# Altium schematic sheet Mainboard_V1.0_Ethernet.SchDoc: Mainboard
size A4; PageSetup: Record=PageOptions|CenterHorizontal=True|CenterVertical=True|PrintScale=0.97|XCorrection=1.00|YCorrection=1.00|PrintKind=0|BorderSize=5000000|LeftOffset=0|BottomOffset=0|Orientation=2|PaperLength=1000|PaperWidth=1000|Scale=100|PaperSource=7|PrintQuality=-3|MediaType=1|DitherType=10|PrintScaleMode=1|PaperKind=A4|PaperIndex=9; Organization: Ostschweizer Fachhochschule; Address2: Florian Baumgartner & Thierry Schwaller; Address3: florian.baumgartner@ost.ch; DocumentNumber: 4; Revision: V1.0; SheetNumber: 4; SheetTotal: 7; Author: Florian Baumgartner & Alain Keller; Subtitle: Ethernet PoE (IEEE 802.3at)
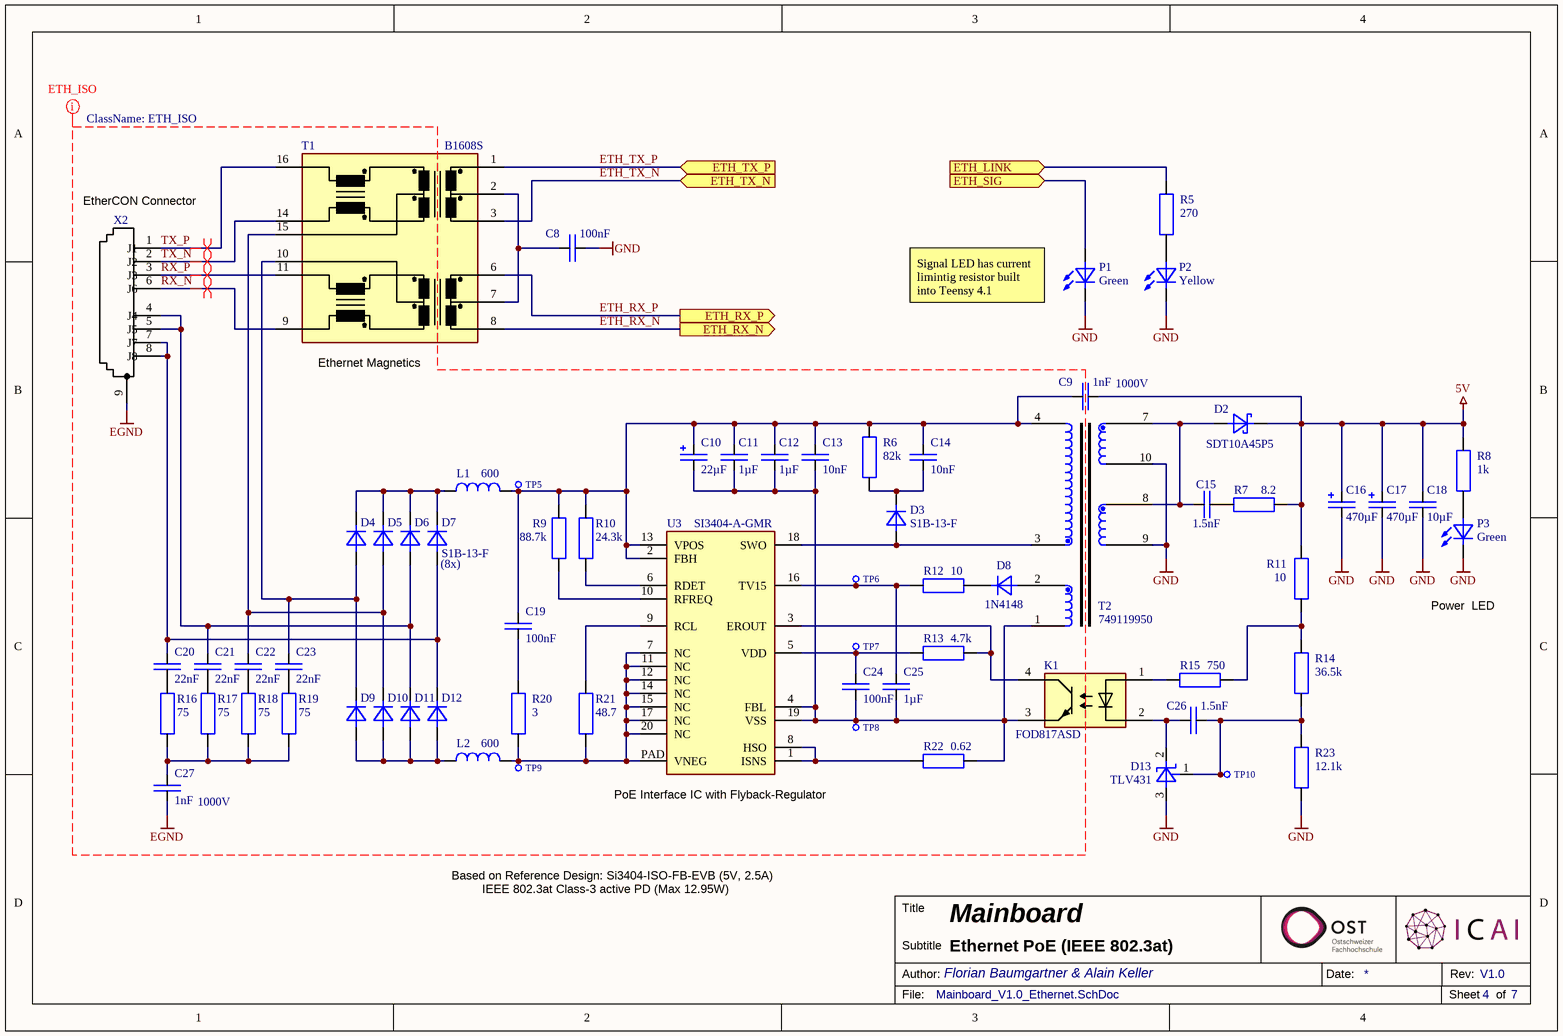
[diagram p0: Mainboard_V1.0_Ethernet.SchDoc]

## Parts
C8  100nF  [SMD Keramikkondensator 0603]
C9  1nF  [SMD KERAMIKKONDENSATOR 1808]
C10  22µF  [SMD Elko 6.3x7.7]
C11  1µF  [SMD Keramikkondensator 1206]
C12  1µF  [SMD Keramikkondensator 1206]
C13  10nF  [SMD Keramikkondensator 0603]
C14  10nF  [SMD Keramikkondensator 0603]
C15  1.5nF  [SMD Keramikkondensator 0603]
C16  470µF  [SMD Elko 6.3x7.7]
C17  470µF  [SMD Elko 6.3x7.7]
C18  10µF  [SMD Keramikkondensator 1206]
C19  100nF  [SMD Keramikkondensator 0805]
C20  22nF  [SMD Keramikkondensator 0603]
C21  22nF  [SMD Keramikkondensator 0603]
C22  22nF  [SMD Keramikkondensator 0603]
C23  22nF  [SMD Keramikkondensator 0603]
C24  100nF  [SMD Keramikkondensator 0603]
C25  1µF  [SMD Keramikkondensator 0603]
C26  1.5nF  [SMD Keramikkondensator 0603]
C27  1nF  [SMD KERAMIKKONDENSATOR 1808]
D2  SDT10A45P5  [SMD Diode PowerDI-5]
D3  S1B-13-F  [SMD Diode DO-214-AC]
D4  S1B-13-F  [SMD Diode DO-214-AC]  (value not drawn)
D5  S1B-13-F  [SMD Diode DO-214-AC]  (value not drawn)
D6  S1B-13-F  [SMD Diode DO-214-AC]  (value not drawn)
D7  S1B-13-F  [SMD Diode DO-214-AC]
D8  1N4148  [SMD Diode SOD-123]
D9  S1B-13-F  [SMD Diode DO-214-AC]  (value not drawn)
D10  S1B-13-F  [SMD Diode DO-214-AC]  (value not drawn)
D11  S1B-13-F  [SMD Diode DO-214-AC]  (value not drawn)
D12  S1B-13-F  [SMD Diode DO-214-AC]  (value not drawn)
D13  TLV431  [SMD IC SOT-23-3]
K1  FOD817ASD  [SMD IC DIP-4]
L1  600  [SMD INDUCTOR/FERRITE 0805]
L2  600  [SMD INDUCTOR/FERRITE 0805]
P1  Green  [SMD LED 0603]
P2  Yellow  [SMD LED 0603]
P3  Green  [SMD LED 0603]
R5  270  [SMD Widerstand 0603]
R6  82k  [SMD Widerstand 0603]
R7  8.2  [SMD Widerstand 0603]
R8  1k  [SMD Widerstand 0603]
R9  88.7k  [SMD Widerstand 0603]
R10  24.3k  [SMD Widerstand 0603]
R11  10  [SMD Widerstand 0603]
R12  10  [SMD Widerstand 0603]
R13  4.7k  [SMD Widerstand 0603]
R14  36.5k  [SMD Widerstand 0603]
R15  750  [SMD Widerstand 0603]
R16  75  [SMD Widerstand 0603]
R17  75  [SMD Widerstand 0603]
R18  75  [SMD Widerstand 0603]
R19  75  [SMD Widerstand 0603]
R20  3  [SMD Widerstand 0603]
R21  48.7  [SMD Widerstand 0603]
R22  0.62  [SMD Widerstand 0603]
R23  12.1k  [SMD Widerstand 0603]
T1  B1608S  [SMD Transformer 500x375]
T2  749119950  [SMD Transformer 749119950]
TP5  X-TP  [THT Testpunkt Ø1mm]  (value not drawn)  (no BOM)
TP6  X-TP  [THT Testpunkt Ø1mm]  (value not drawn)  (no BOM)
TP7  X-TP  [THT Testpunkt Ø1mm]  (value not drawn)  (no BOM)
TP8  X-TP  [THT Testpunkt Ø1mm]  (value not drawn)  (no BOM)
TP9  X-TP  [THT Testpunkt Ø1mm]  (value not drawn)  (no BOM)
TP10  X-TP  [THT Testpunkt Ø1mm]  (value not drawn)  (no BOM)
U3  SI3404-A-GMR  [SMD IC QFN-20]
X2  NE8FBV-C5-LED1-S  [THT CONNECTOR NE8FBV-C5-LED1-S]  (value not drawn)

## Ports
ETH_LINK (in), ETH_RX_N (out), ETH_RX_P (out), ETH_SIG (in), ETH_TX_N (in), ETH_TX_P (in)

## Nets
5V: C9.1 C16.P(+) C17.P(+) C18.2 D2.K R7.1 R8.2 R11.1
EGND: C27.1 X2.9
GND: C8.2 C16.M(-) C17.M(-) C18.1 D13.3(A) P1.K P2.K P3.K R23.2 T2.9 T2.10
ETH_LINK: R5.1 ; port ETH_LINK
ETH_RX_N: T1.8(RD-) ; port ETH_RX_N
ETH_RX_P: T1.6(RD+) ; port ETH_RX_P
ETH_SIG: P1.A ; port ETH_SIG
ETH_TX_N: T1.3(TD-) ; port ETH_TX_N
ETH_TX_P: T1.1(TD+) ; port ETH_TX_P
RX_N: T1.9(RX-) X2.6
RX_P: T1.11(RX+) X2.3
TX_N: T1.14(TX-) X2.2
TX_P: T1.16(TX+) X2.1
NetC8_1: C8.1 T1.2(TCT) T1.7(RCT)
NetC9_2: C9.2 C10.P(+) C11.2 C12.2 C13.1 C14.1 C19.1 L1.2 R6.1 R9.1 R10.1 T2.4 TP5.1 U3.2(FBH) U3.13(VPOS)
NetC10_M: C10.M(-) C11.1 C12.1 C13.2 C24.2 C25.1 K1.3(TE) R22.2 T2.1 TP8.1 U3.4(FBL) U3.19(VSS)
NetC14_2: C14.2 D3.K R6.2
NetC15_1: C15.1 R7.2
NetC15_2: C15.2 D2.A T2.7 T2.8
NetC19_2: C19.2 R20.1
NetC20_1: C20.1 D7.A D12.K X2.7 X2.8
NetC20_2: C20.2 R16.1
NetC21_1: C21.1 D6.A D11.K X2.4 X2.5
NetC21_2: C21.2 R17.1
NetC22_1: C22.1 D5.A D10.K T1.15(TXCT)
NetC22_2: C22.2 R18.1
NetC23_1: C23.1 D4.A D9.K T1.10(RXCT)
NetC23_2: C23.2 R19.1
NetC24_1: C24.1 R13.2 TP7.1 U3.5(VDD)
NetC25_2: C25.2 R12.2 TP6.1 U3.16(TV15)
NetC26_1: C26.1 D13.1(REF) R14.2 R23.1 TP10.1
NetC26_2: C26.2 D13.2(C) K1.2(LC)
NetC27_2: C27.2 R16.2 R17.2 R18.2 R19.2
NetD3_A: D3.A T2.3 U3.18(SWO)
NetD4_K: D4.K D5.K D6.K D7.K L1.1
NetD8_A: D8.A T2.2
NetD8_K: D8.K R12.1
NetD9_A: D9.A D10.A D11.A D12.A L2.1
NetK1_1: K1.1(LA) R15.1
NetK1_4: K1.4(TC) R13.1 U3.3(EROUT)
NetL2_2: L2.2 R20.2 R21.2 TP9.1 U3.7(NC) U3.11(NC) U3.12(NC) U3.14(NC) U3.15(NC) U3.17(NC) U3.20(NC) U3.PAD(VNEG)
NetP2_A: P2.A R5.2
NetP3_A: P3.A R8.1
NetR9_2: R9.2 U3.10(RFREQ)
NetR10_2: R10.2 U3.6(RDET)
NetR11_2: R11.2 R14.1 R15.2
NetR21_1: R21.1 U3.9(RCL)
NetR22_1: R22.1 U3.1(ISNS) U3.8(HSO)

Not connected (* = marked no-connect by the designer): T1 4(NC) 5(NC) 12(NC) 13(NC); T2 5 6

## Layout directives
net class ETH_ISO: EGND, RX_N, RX_P, TX_N, TX_P
differential pair: RX_N, RX_P, TX_N, TX_P

## Notes on the sheet
- (near X2) EtherCON Connector
- (near P1) Signal LED has current limintig resistor built into Teensy 4.1
- (near T1) Ethernet Magnetics
- 1000V
- (near D7) (8x)
- Power  LED
- (near U3) PoE Interface IC with Flyback-Regulator
- (near C27) 1000V
- IEEE 802.3at Class-3 active PD (Max 12.95W)
- Based on Reference Design: Si3404-ISO-FB-EVB (5V, 2.5A)
- Title
- Author:
- Subtitle
- Date:
- Rev:
- File:
- Sheet
- of
- (in symbol X-NE8FBV-C5-LED1-S) J1; J2; J3; J6; J4; J5; J7; J8

## Library data of the parts
C8 C24 = E6 - 100nF: SMD Ceramic Capacitor E6; Component Value: 100nF 50V; Component Description: Multilayer Ceramic Capacitors; ComponentLink1Description: Datasheet; ComponentLink1URL: https://datasheet.lcsc.com/lcsc/1809301912_YAGEO-CC0603KRX7R9BB104_C14663.pdf; Digikey: 445-5666-1-ND; Farnell: 2522432; JLC-Parts: C14663; Mouser: 77-VJ0603V104ZXAPBC; Unit Price: 0.01
C9 C27 = E6 - 1nF: SMD Ceramic Capacitor E6; Component Value: 1nF 3kV; Component Description: Multilayer Ceramic Capacitors MLCC; ComponentLink1Description: Datasheet; ComponentLink1URL: https://datasheet.lcsc.com/lcsc/1912111437_Johanson-Dielectrics-302R29W102KV4E_C173224.pdf; Digikey: 709-1047-1-ND; Farnell: 1886070; JLC-Parts: C173224; Mouser: 605-302R29W102KV4E; Unit Price: 0.06
C10 = C-ELCAP: CAP-Elko; Component Description: Electrolytic Capacitor; Component Value: 22µF 100V; JLC-Parts: C5456761; Unit Price: 0.06
C11 C12 = C-CAPACITOR: CAP-MK; Component Description: Multilayer Ceramic Capacitors; Component Value: 1µF 100V; Digikey: 720-VJ1206Y104MXBATCT-ND; Farnell: 1657939; Mouser: 77-VJ1206Y104MXBAT; JLC-Parts: C13832; Unit Price: 0.01
C13 C14 = E6 - 22nF: SMD Ceramic Capacitor E6; Component Value: 10nF 100V; Component Description: Multilayer Ceramic Capacitors MLCC; ComponentLink1Description: Datasheet; ComponentLink1URL: https://datasheet.lcsc.com/lcsc/1811101610_Samsung-Electro-Mechanics-CL10B223KB8NNNC_C21122.pdf; Digikey: 490-4781-1-ND; Farnell: 2470432; JLC-Parts: C302008; Mouser: 81-GCM188R72A103KA7D; Unit Price: 0.01
C15 C26 = C-CAPACITOR: CAP-MK; Component Description: Multilayer Ceramic Capacitors; Component Value: 1.5nF 50V; Digikey: 445-6920-1-ND; Farnell: 2435474; Mouser: 810-CGA3E2X7R1H152K; JLC-Parts: C1595; Unit Price: 0.01
C16 C17 = C-ELCAP: CAP-Elko; Component Description: Electrolytic Capacitor; Component Value: 470µF 6.3V; JLC-Parts: C72520; Unit Price: 0.03
C18 = E6 - 10uF: SMD Ceramic Capacitor E6; Component Value: 10µF 50V; Component Description: Multilayer Ceramic Capacitors MLCC; ComponentLink1Description: Datasheet; ComponentLink1URL: https://datasheet.lcsc.com/lcsc/1810191219_Samsung-Electro-Mechanics-CL10A106KP8NNNC_C19702.pdf; Digikey: 587-3258-1-ND; Farnell: 2113070; JLC-Parts: C13585; Mouser: 963-LMK107BBJ106MALT; Unit Price: 0.01
C19 = E6 - 22nF: SMD Ceramic Capacitor E6; Component Value: 100nF 100V; Component Description: Multilayer Ceramic Capacitors MLCC; ComponentLink1Description: Datasheet; ComponentLink1URL: https://datasheet.lcsc.com/lcsc/1811101610_Samsung-Electro-Mechanics-CL10B223KB8NNNC_C21122.pdf; Digikey: 490-4789-1-ND; Farnell: 2470440; JLC-Parts: C28233; Mouser: 81-GCM21BR72A104KA7L; Unit Price: 0.01
C20-C23 = E6 - 22nF: SMD Ceramic Capacitor E6; Component Value: 22nF 100V; Component Description: Multilayer Ceramic Capacitors MLCC; ComponentLink1Description: Datasheet; ComponentLink1URL: https://datasheet.lcsc.com/lcsc/1811101610_Samsung-Electro-Mechanics-CL10B223KB8NNNC_C21122.pdf; Digikey: 490-4782-1-ND; Farnell: 2494195; JLC-Parts: C161234; Mouser: 81-GCM188R72A223KA7D; Unit Price: 0.01
C25 = C-CAPACITOR: CAP-MK; Component Description: Multilayer Ceramic Capacitors; Component Value: 1µF 50V; Digikey: 1276-1860-1-ND; Farnell: 3013383; Mouser: 187-CL10A105KB8NNNC; JLC-Parts: C15849; Unit Price: 0.01
D2 = R-DIODE:SCHKY: Trench Schottky Barrier Rectifier; Component Value: SDT10A45P5-13; Mouser: 621-SDT10A45P5-13; Farnell: 3944970; Digikey: 31-SDT10A45P5-13CT-ND; JLC-Parts: C2997843; Component Description: Trench Schottky Barrier Rectifier; Unit Price: 0.19; ComponentLink1Description: Datasheet; ComponentLink1URL: https://www.diodes.com/assets/Datasheets/SDT10A45P5.pdf
D3-D7 D9-D12 = R-DIODE: DIODE (alt V); Component Description: General Purpose Rectifier Diode; Digikey: S1B-FDICT-ND; Farnell: 3127425; Mouser: 621-S1B-F; ComponentLink1Description: Datasheet; ComponentLink1URL: https://www.diodes.com/assets/Datasheets/ds16003.pdf; Component Value: S1B-13-F; JLC-Parts: C156295; Unit Price: 0.03
D8 = R-DIODE: DIODE (alt V); Component Description: Fast Switching Diode; Component Value: 1N4148WTR; Digikey: 1655-1360-1-ND; Farnell: 2306363; Mouser: 750-1N4148W-HF; ComponentLink1Description: Datasheet; ComponentLink1URL: https://datasheet.lcsc.com/lcsc/1811061725_ST-Semtech-1N4148W_C81598.pdf; JLC-Parts: C81598; Unit Price: 0.01
D13 = D-Voltage-Refference: Low-Voltage Adjustable Precision Shunt Regulator; Component Value: TLV431BCDBZR; Mouser: 595-TLV431BCDBZR; Digikey: 296-17569-1-ND; JLC-Parts: C2156583; ComponentLink1Description: Datasheet; ComponentLink1URL: https://www.ti.com/general/docs/suppproductinfo.tsp?distId=10&gotoUrl=https%3A%2F%2Fwww.ti.com%2Flit%2Fgpn%2Ftlv431a; Component Description: Low-Voltage Adjustable Precision Shunt Regulator; Unit Price: 0.59
K1 = K-FOD817ASD: Phototransistor Optocoupler; Digikey: FOD817ASDDKR-ND; Farnell: 2322515; Mouser: 512-FOD817ASD; Component Description: Phototransistor Optocoupler; ComponentLink1Description: Datasheet; ComponentLink1URL: https://rocelec.widen.net/view/pdf/yhg4flovvn/ONSM-S-A0003163276-1.pdf?t.download=true&u=5oefqw; Component Value: FOD817ASD; JLC-Parts: C241830; Unit Price: 0.25
L1 L2 = R-COIL (HF): COIL (Spule alt L); Component Description: Ferrite Bead; Component Value: CBM201209U601T (600 Ohm@100MHz, 2000mA); Farnell: 1838838; Mouser: 623-2508056017Y2; Digikey: 1934-1487-1-ND; ComponentLink1Description: Datasheet; ComponentLink1URL: https://datasheet.lcsc.com/lcsc/2304140030_FH--Guangdong-Fenghua-Advanced-Tech-CBM201209U601T_C139168.pdf; JLC-Parts: C139168; Unit Price: 0.01
P1 = P-LED: LED (als Lampe E / alt H); Component Description: General Purpose LED; Component Value: Green (5mA, 2.4V); Digikey: 350-2035-1-ND; Farnell: 1465991; Mouser: 645-598-8070-107F; ComponentLink1Description: Datasheet; ComponentLink1URL: https://datasheet.lcsc.com/szlcsc/Everlight-Elec-19-217-GHC-YR1S2-3T_C72043.pdf; JLC-Parts: C72043; Unit Price: 0.34
P2 = P-LED: LED (als Lampe E / alt H); Component Description: General Purpose LED; Component Value: Yellow (5mA, 2.1V); Digikey: 350-2033-1-ND; Farnell: 1867103; Mouser: 645-598-8050-107F; ComponentLink1Description: Datasheet; ComponentLink1URL: https://datasheet.lcsc.com/szlcsc/Everlight-Elec-19-213-Y2C-CQ2R2L-3T-CY_C72038.pdf; JLC-Parts: C72038; Unit Price: 0.34
P3 = LED Green 0603: General Purpose LED; Component Value: Green (5mA, 2.4V); Digikey: 350-2035-1-ND; Farnell: 1465991; Mouser: 645-598-8070-107F; Unit Price: 0.34; ComponentLink1Description: Datasheet; ComponentLink1URL: https://datasheet.lcsc.com/szlcsc/Everlight-Elec-19-217-GHC-YR1S2-3T_C72043.pdf; JLC-Parts: C72043; Component Description: General Purpose LED
R5 = R-RESISTOR: SMD-Widerstand 1/4W; Component Description: Thick Film Chip Resistor; Component Value: 270 (75V, 100mW, 1%); Digikey: P270HCT-ND; Farnell: 2303096; Mouser: 667-ERJ-3EKF2700V; JLC-Parts: C22966; Unit Price: 0.06
R6 = R-RESISTOR: RES (E=Heizwiderstand B=Messwandler); Component Description: Thick Film Chip Resistor; Component Value: 82k (75V, 100mW, 1%); Digikey: P82.0KHCT-ND; Farnell: 2303225; Mouser: 667-ERJ-3EKF8202V; ComponentLink1Description: Datasheet; ComponentLink1URL: https://datasheet.lcsc.com/lcsc/1810200710_UNI-ROYAL-Uniroyal-Elec-0603WAF4701T5E_C23162.pdf; JLC-Parts: C23254; Unit Price: 0.01
R7 = R-RESISTOR: RES (E=Heizwiderstand B=Messwandler); Component Description: Thick Film Chip Resistor; Component Value: 8.2 (75V, 100mW, 1%); Digikey: P8.2AJCT-ND; Farnell: 1717784; Mouser: 667-ERJ-3RQF8R2V; JLC-Parts: C322222; Unit Price: 0.01
R8 = R-RESISTOR: RES (E=Heizwiderstand B=Messwandler); Component Description: Dickschicht Chipwiderstand; Component Value: 1k (75V, 100mW, 1%); Digikey: P1.00KHCT-ND; Farnell: 2303145; Mouser: 667-ERJ-3EKF1001V; JLC-Parts: C21190; Unit Price: 0.01
R9 = R-RESISTOR: RES (E=Heizwiderstand B=Messwandler); Component Description: Thick Film Chip Resistor; Component Value: 88.7k (75V, 100mW, 1%); Digikey: P88.7KHCT-ND; Farnell: 2059491; Mouser: 667-ERJ-3EKF8872V; ComponentLink1Description: Datasheet; ComponentLink1URL: https://datasheet.lcsc.com/lcsc/1810200710_UNI-ROYAL-Uniroyal-Elec-0603WAF4701T5E_C23162.pdf; JLC-Parts: C23258; Unit Price: 0.01
R10 = R-RESISTOR: RES (E=Heizwiderstand B=Messwandler); Component Description: Thick Film Chip Resistor; Component Value: 24.3k (75V, 100mW, 1%); Digikey: P24.3KHCT-ND; Farnell: 2059442; Mouser: 667-ERJ-3EKF2432V; ComponentLink1Description: Datasheet; ComponentLink1URL: https://datasheet.lcsc.com/lcsc/1810200710_UNI-ROYAL-Uniroyal-Elec-0603WAF4701T5E_C23162.pdf; JLC-Parts: C276290; Unit Price: 0.01
R11 R12 = R-RESISTOR: RES (E=Heizwiderstand B=Messwandler); Component Description: Thick Film Chip Resistor; Component Value: 10 (75V, 100mW, 1%); Digikey: P10.0HCT-ND; Farnell: 2302958; Mouser: 667-ERJ-3EKF10R0V; JLC-Parts: C22859; Unit Price: 0.01
R13 = R-RESISTOR: RES (E=Heizwiderstand B=Messwandler); Component Description: Thick Film Chip Resistor; Component Value: 4.7k (75V, 100mW, 1%); Digikey: P4.70KHCT-ND; Farnell: 2059378; Mouser: 667-ERJ-3EKF4701V; JLC-Parts: C23162; Unit Price: 0.01
R14 = R-RESISTOR: RES (E=Heizwiderstand B=Messwandler); Component Description: Thick Film Chip Resistor; Component Value: 36.5k (75V, 100mW, 1%); Digikey: P36.5KHCT-ND; Farnell: 2059461; Mouser: 667-ERJ-3EKF3652V; ComponentLink1Description: Datasheet; ComponentLink1URL: https://datasheet.lcsc.com/lcsc/1810200710_UNI-ROYAL-Uniroyal-Elec-0603WAF4701T5E_C23162.pdf; JLC-Parts: C403185; Unit Price: 0.01
R15 = R-RESISTOR: RES (E=Heizwiderstand B=Messwandler); Component Description: Thick Film Chip Resistor; Component Value: 750 (75V, 100mW, 1%); Digikey: P750HCT-ND; Farnell: 2059323; Mouser: 667-ERJ-3EKF7500V; ComponentLink1Description: Datasheet; ComponentLink1URL: https://datasheet.lcsc.com/lcsc/1810200710_UNI-ROYAL-Uniroyal-Elec-0603WAF4701T5E_C23162.pdf; JLC-Parts: C23241; Unit Price: 0.01
R16-R19 = R-RESISTOR: RES (E=Heizwiderstand B=Messwandler); Component Description: Thick Film Chip Resistor; Component Value: 75 (75V, 100mW, 1%); Digikey: P75.0HCT-ND; Farnell: 2059282; Mouser: 667-ERJ-3EKF75R0V; ComponentLink1Description: Datasheet; ComponentLink1URL: https://datasheet.lcsc.com/lcsc/1810200710_UNI-ROYAL-Uniroyal-Elec-0603WAF4701T5E_C23162.pdf; JLC-Parts: C4275; Unit Price: 0.01
R20 = R-RESISTOR: RES (E=Heizwiderstand B=Messwandler); Component Description: Thick Film Chip Resistor; Component Value: 3 (75V, 100mW, 1%); Digikey: 541-3.00SCT-ND; Farnell: 3546376; Mouser: 71-CRCW06033R00FKEAH; ComponentLink1Description: Datasheet; ComponentLink1URL: https://datasheet.lcsc.com/lcsc/2206010116_UNI-ROYAL-Uniroyal-Elec-0603WAF300KT5E_C23157.pdf; JLC-Parts: C23157; Unit Price: 0.01
R21 = R-RESISTOR: RES (E=Heizwiderstand B=Messwandler); Component Description: Thick Film Chip Resistor; Component Value: 48.7 (75V, 100mW, 1%); Digikey: P48.7HCT-ND; Farnell: 2303031; Mouser: 667-ERJ-3EKF48R7V; ComponentLink1Description: Datasheet; ComponentLink1URL: https://datasheet.lcsc.com/lcsc/1810200710_UNI-ROYAL-Uniroyal-Elec-0603WAF4701T5E_C23162.pdf; JLC-Parts: C2692820; Unit Price: 0.01
R22 = R-RESISTOR: RES (E=Heizwiderstand B=Messwandler); Component Description: Thick Film Chip Resistor; Component Value: 0.62 (75V, 100mW, 1%); Digikey: 311-.62QCT-ND; Farnell: 3923404; Mouser: 603-RL0603FR-070R62L; ComponentLink1Description: Datasheet; ComponentLink1URL: https://www.farnell.com/datasheets/3046086.pdf; JLC-Parts: C175661; Unit Price: 0.01
R23 = R-RESISTOR: RES (E=Heizwiderstand B=Messwandler); Component Description: Thick Film Chip Resistor; Component Value: 12.1k (75V, 100mW, 1%); Digikey: P12.1KHCT-ND; Farnell: 2059413; Mouser: 667-ERJ-3EKF1212V; ComponentLink1Description: Datasheet; ComponentLink1URL: https://datasheet.lcsc.com/lcsc/1810200710_UNI-ROYAL-Uniroyal-Elec-0603WAF4701T5E_C23162.pdf; JLC-Parts: C22864; Unit Price: 0.01
T1 = T-B1608S: LAN 10/100 Base-T Pulse Transformer with PoE; ComponentLink1Description: Datasheet; ComponentLink1URL: https://mm.digikey.com/Volume0/opasdata/d220001/medias/docus/696/SM13126PEL.pdf; Component Value: B1608S; Digikey: SM13126PELCT-ND; Farnell: 3225384; JLC-Parts: C507596; Mouser: 652-SM13126PEL; Unit Price: 0.24; Component Description: LAN 10/100 Base-T Pulse Transformer with PoE
T2 = T-Transformer_749119950: PoE Power Transformer; Component Value: 749119950 (5V); Component Description: PoE Power Transformer; ComponentLink1Description: Datasheet; ComponentLink1URL: https://www.we-online.com/components/products/datasheet/749119950.pdf; Digikey: 732-2432-1-ND; Mouser: 710-749119950; Unit Price: 5.42
TP5-TP10 = X-TP: Testpunkt; Component Value: Ø 0.8mm; Component Description: Testpunkt; Unit Price: 0.00
U3 = U-SI3404-A-GMR: IEEE 802.3 Type 1-Compliant POE PD Interface; Component Description: Low-Power Audio Codec with Headphones Driver; ComponentLink1Description: Datasheet; ComponentLink1URL: https://www.skyworksinc.com/-/media/Skyworks/SL/documents/public/data-sheets/si3404-datasheet.pdf; Digikey: 863-SI3404-A-GMRDKR-ND; Component Value: SI3404-A-GMR; Farnell: 3387044; JLC-Parts: C461934; Mouser: 634-SI3404-A-GMR; Unit Price: 1.37
X2 = X-NE8FBV-C5-LED1-S: RJ45 etherCON (Cat 5e); Component Value: NE8FBV-C5-LED1-S; Farnell: 2543779; Mouser: 568-NE8FBV-C5-LED1-S; Unit Price: 20.67; ComponentLink1Description: Datasheet; ComponentLink1URL: https://www.mouser.ch/datasheet/2/289/st-ne8fbv-c5-led1-s-1-1854026.pdf; Component Description: RJ45 etherCON (Cat 5e)